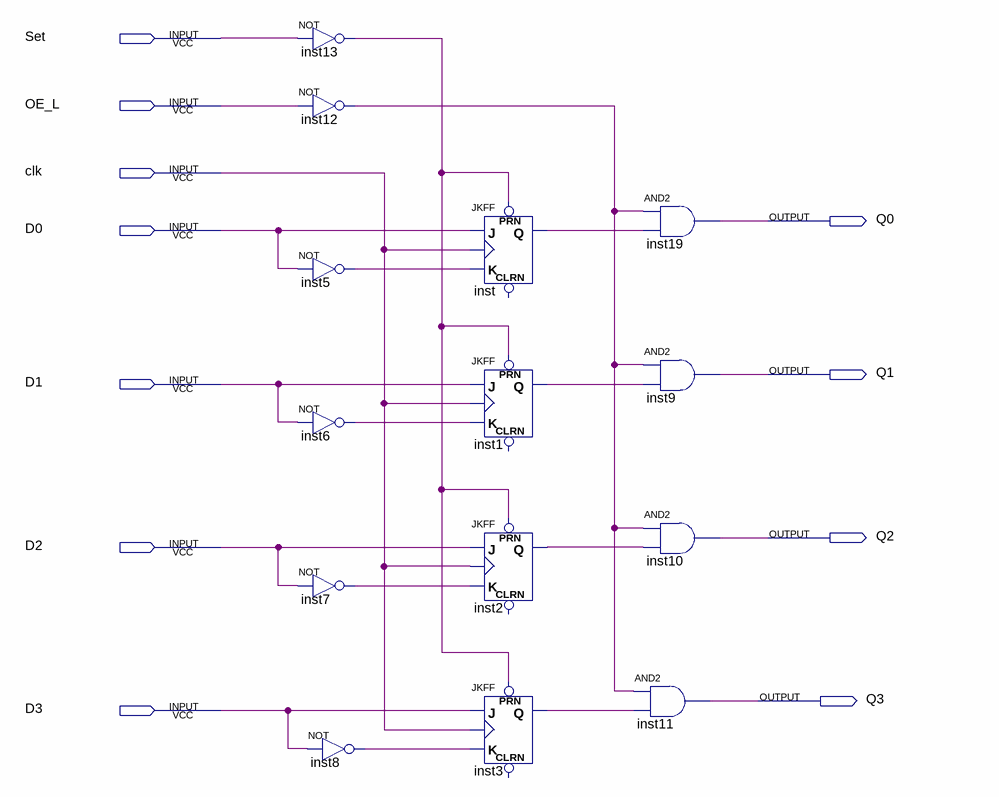
[diagram p0: schematic sheet]
// Quartus schematic lab4_regJK.bdf as structural Verilog: 14 symbols, 11 pins
module lab4_regJK (
  input  Set,
  input  OE_L,
  input  clk,
  input  D0,
  input  D1,
  input  D2,
  input  D3,
  output Q0,
  output Q1,
  output Q2,
  output Q3
);

  wire inst1_q, inst2_q, inst3_q, inst5_out, inst6_out, inst7_out, inst8_out, inst12_out, inst13_out, inst_q;

  not inst13 (inst13_out, Set);
  not inst12 (inst12_out, OE_L);
  not inst5 (inst5_out, D0);
  not inst6 (inst6_out, D1);
  not inst7 (inst7_out, D2);
  not inst8 (inst8_out, D3);
  JKFF inst (.PRN(inst13_out), .K(inst5_out), .J(D0), .CLK(clk), .Q(inst_q));  // open: CLRN
  JKFF inst1 (.PRN(inst13_out), .K(inst6_out), .J(D1), .CLK(clk), .Q(inst1_q));  // open: CLRN
  JKFF inst2 (.PRN(inst13_out), .K(inst7_out), .J(D2), .CLK(clk), .Q(inst2_q));  // open: CLRN
  JKFF inst3 (.PRN(inst13_out), .K(inst8_out), .J(D3), .CLK(clk), .Q(inst3_q));  // open: CLRN
  and inst11 (Q3, inst12_out, inst3_q);
  and inst19 (Q0, inst12_out, inst_q);
  and inst9 (Q1, inst12_out, inst1_q);
  and inst10 (Q2, inst12_out, inst2_q);
endmodule
